# EAGLE schematic VentilationsEvaluationDevBoard_v2.1.4_USB_C (EAGLE 9.6.2)
TEST: 1234

## Sheet 1 of 3
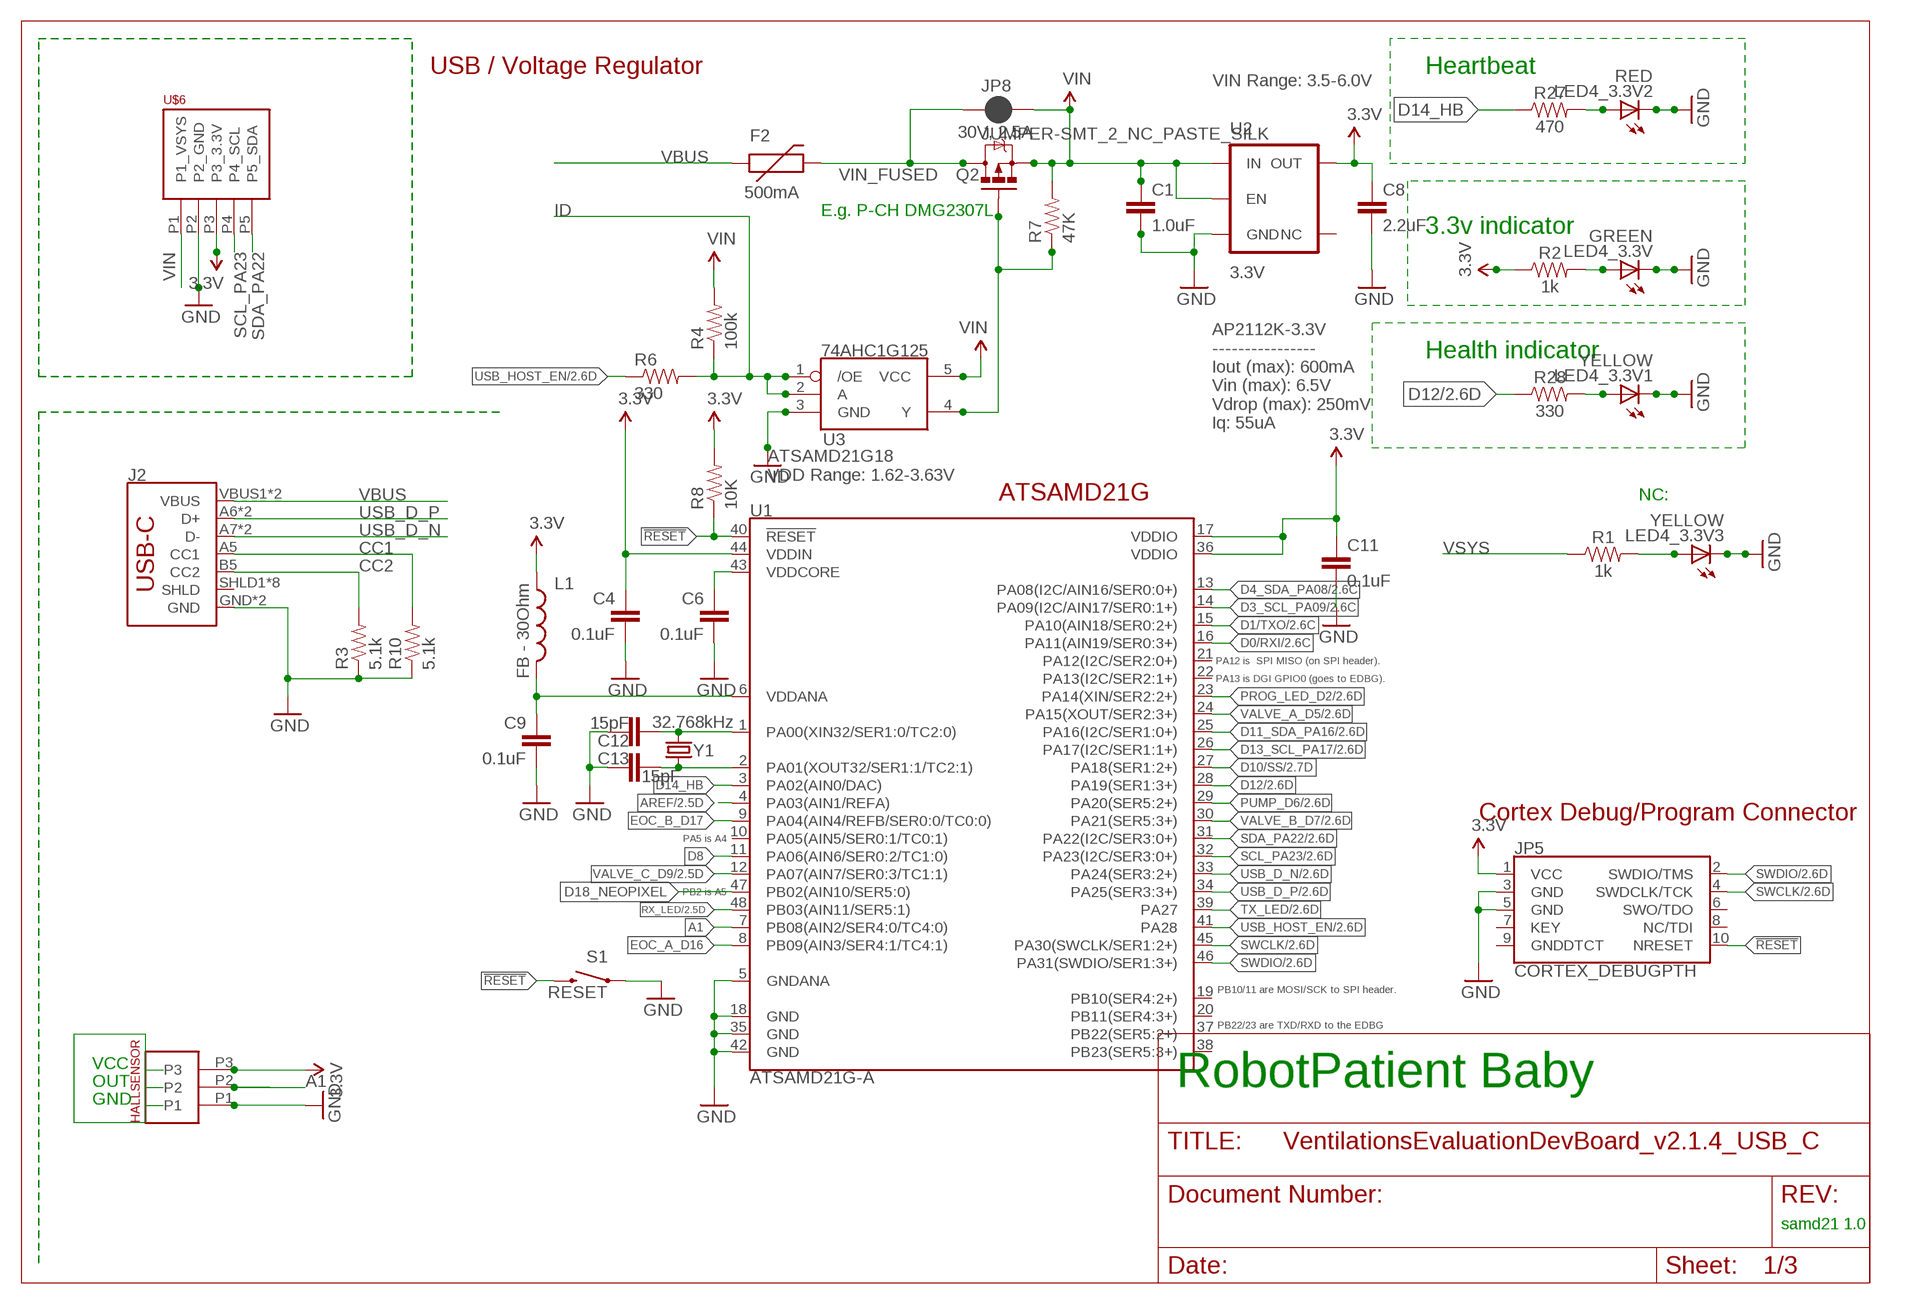
[diagram p0: schematic, sheet 1]

### Parts
C1  1.0uF  1.0UF-25V-+80/-20(0805)  [0805]
C4  0.1uF  0.1UF-16V(+-10%)(0402)  [0402-CAP]
C6  0.1uF  0.1UF-16V(+-10%)(0402)  [0402-CAP]
C8  2.2uF  2.2UF-10V-20%(0603)  [0603-CAP]
C9  0.1uF  0.1UF-16V(+-10%)(0402)  [0402-CAP]
C11  0.1uF  0.1UF-16V(+-10%)(0402)  [0402-CAP]
C12  15pF  15PF-50V(+-5%)(0402)  [0402-CAP]
C13  15pF  15PF-50V(+-5%)(0402)  [0402-CAP]
F2  500mA  PTCSMD  [PTC-1206]
HALLSENSOR  PHOENIX_PTSM_M3_TH_UP  [PTSM_M3_THR_UP]
J2  USB_C16PIN  [USB-C-16P]
JP5  CORTEX_DEBUGPTH  [2X5-PTH-1.27MM]
JP8  JUMPER-SMT_2_NC_PASTE_SILK  [SMT-JUMPER_2_NC_PASTE_SILK]
L1  FB - 30Ohm  INDUCTOR0603  [0603]
LED4_3.3V  GREEN  LED0603  [LED-0603]
LED4_3.3V1  YELLOW  LED0603  [LED-0603]
LED4_3.3V2  RED  LED0603  [LED-0603]
LED4_3.3V3  YELLOW  LED0603  [LED-0603]
Q2  30V, 2.5A  MOSFET-PCHANNELDMG2307L  [SOT23-3]
R1  1k  1KOHM-0603-1/10W-1%  [0603]
R2  1k  1KOHM-0603-1/10W-1%  [0603]
R3  5.1k  10KOHM-1/10W-1%(0603)0603  [0603-RES]
R4  100k  100KOHM-1/10W-1%(0603)  [0603-RES]
R6  330  330OHM1/10W1%(0603)  [0603-RES]
R7  47K  47KOHM1/10W1%(0603)  [0603-RES]
R8  10K  10KOHM-1/10W-1%(0603)0603  [0603-RES]
R10  5.1k  10KOHM-1/10W-1%(0603)0603  [0603-RES]
R27  470  470OHM-0603-1/10W-1%  [0603]
R28  330  330OHM-0603-1/10W-1%  [0603]
S1  RESET  SWITCH-MOMENTARY-2SMD-4.6X2.8MM  [TACTILE_SWITCH_SMD_4.6X2.8MM]
U1  ATSAMD21G-A  [TQFP-48]
U2  3.3V  V_REG_AP2112K-3.3V  [SOT23-5]
U3  74AHC1G125  [SOT23-5]
U$6  PHOENIX_PTSM_M5_TH_UP  [PTSM_M5_THR_UP]
Y1  32.768kHz  CRYSTAL3.2X1.5MM  [CRYSTAL-SMD-3.2X1.5MM]

### Nets
3.3V [power]: C4.1 C8.1 C11.1 HALLSENSOR.P3 JP5.1(VCC) L1.1 R2.1 R8.2 U1.17(VDDIO) U1.36(VDDIO) U1.44(VDDIN) U2.5(OUT) U$6.P3(P3_3.3V) ; also sheet 2,3
!RESET: JP5.10(NRESET) R8.1 S1.3 S1.4 U1.40(!RESET!)
A1: HALLSENSOR.P2 U1.7(PB08(AIN2/SER4:0/TC4:0))
AREF: U1.4(PA03(AIN1/REFA)) ; also sheet 2
CC1: J2.A5(CC1) R10.2
CC2: J2.B5(CC2) R3.2
D0/RXI: U1.16(PA11(AIN19/SER0:3+)) ; also sheet 2
D1/TXO: U1.15(PA10(AIN18/SER0:2+)) ; also sheet 2
D3_SCL_PA09: U1.14(PA09(I2C/AIN17/SER0:1+)) ; also sheet 2,3
D4_SDA_PA08: U1.13(PA08(I2C/AIN16/SER0:0+)) ; also sheet 2,3
D8: U1.11(PA06(AIN6/SER0:2/TC1:0))
D10/SS: U1.27(PA18(SER1:2+)) ; also sheet 2
D11_SDA_PA16: U1.25(PA16(I2C/SER1:0+)) ; also sheet 2,3
D12: R28.1 U1.28(PA19(SER1:3+)) ; also sheet 2
D13_SCL_PA17: U1.26(PA17(I2C/SER1:1+)) ; also sheet 2,3
D14_HB: R27.1 U1.3(PA02(AIN0/DAC))
D18_NEOPIXEL: U1.47(PB02(AIN10/SER5:0)) ; also sheet 2
EOC_A_D16: U1.8(PB09(AIN3/SER4:1/TC4:1)) ; also sheet 3
EOC_B_D17: U1.9(PA04(AIN4/REFB/SER0:0/TC0:0)) ; also sheet 3
GND [ground]: C1.2 C4.2 C6.2 C8.2 C9.2 C11.2 C12.1 C13.2 HALLSENSOR.P1 J2.GND J2.GND2(GND) JP5.3(GND) JP5.5(GND) LED4_3.3V1.C LED4_3.3V2.C LED4_3.3V3.C LED4_3.3V.C R3.1 R10.1 S1.1 S1.2 U1.5(GNDANA) U1.18(GND) U1.35(GND) U1.42(GND) U2.2(GND) U3.3(GND) U$6.P2(P2_GND) ; also sheet 2,3
ID: R4.1 R6.2 U3.1(/OE) U3.2(A)
N$1: LED4_3.3V2.A R27.2
N$2: LED4_3.3V1.A R28.2
N$3: LED4_3.3V3.A R1.2
N$8: C12.2 U1.1(PA00(XIN32/SER1:0/TC2:0)) Y1.P$2
N$12: Q2.1(G) R7.1 U3.4(Y)
N$13: C13.1 U1.2(PA01(XOUT32/SER1:1/TC2:1)) Y1.P$1
N$33: LED4_3.3V.A R2.2
PROG_LED_D2: U1.23(PA14(XIN/SER2:2+)) ; also sheet 2
PUMP_D6: U1.29(PA20(SER5:2+)) ; also sheet 2,3
RX_LED: U1.48(PB03(AIN11/SER5:1)) ; also sheet 2
SCL_PA23: U1.32(PA23(I2C/SER3:0+)) U$6.P4(P4_SCL) ; also sheet 2
SDA_PA22: U1.31(PA22(I2C/SER3:0+)) U$6.P5(P5_SDA) ; also sheet 2
SWCLK: JP5.4(SWDCLK/TCK) U1.45(PA30(SWCLK/SER1:2+)) ; also sheet 2
SWDIO: JP5.2(SWDIO/TMS) U1.46(PA31(SWDIO/SER1:3+)) ; also sheet 2
TX_LED: U1.39(PA27) ; also sheet 2
USB_D_N [diff_pair]: J2.A7(D-) J2.B7(D-) U1.33(PA24(SER3:2+)) ; also sheet 2
USB_D_P [diff_pair]: J2.A6(D+) J2.B6(D+) U1.34(PA25(SER3:3+)) ; also sheet 2
USB_HOST_EN: R6.1 U1.41(PA28) ; also sheet 2
VALVE_A_D5: U1.24(PA15(XOUT/SER2:3+)) ; also sheet 2,3
VALVE_B_D7: U1.30(PA21(SER5:3+)) ; also sheet 2,3
VALVE_C_D9: U1.12(PA07(AIN7/SER0:3/TC1:1)) ; also sheet 2,3
VBUS [power]: F2.1 J2.VBUS1(VBUS) J2.VBUS2(VBUS)
VDDANA [power]: C9.1 L1.2 U1.6(VDDANA)
VDDCORE [power]: C6.1 U1.43(VDDCORE)
VIN [power]: C1.1 JP8.2 Q2.2(S) R4.2 R7.2 U2.1(IN) U2.3(EN) U3.5(VCC) U$6.P1(P1_VSYS) ; also sheet 2
VIN_FUSED [power]: F2.2 JP8.1 Q2.3(D) ; also sheet 2
VSYS [power]: R1.1 ; also sheet 2
Unconnected: J2.SHLD1(SHLD) J2.SHLD2(SHLD) J2.SHLD3(SHLD) J2.SHLD4(SHLD) J2.SHLD5(SHLD) J2.SHLD6(SHLD) J2.SHLD7(SHLD) J2.SHLD8(SHLD) JP5.6(SWO/TDO) JP5.7(KEY) JP5.8(NC/TDI) JP5.9(GNDDTCT) U1.10(PA05(AIN5/SER0:1/TC0:1)) U1.19(PB10(SER4:2+)) U1.20(PB11(SER4:3+)) U1.21(PA12(I2C/SER2:0+)) U1.22(PA13(I2C/SER2:1+)) U1.37(PB22(SER5:2+)) U1.38(PB23(SER5:3+)) U2.4(NC)

### Notes on the sheet
- USB / Voltage Regulator
- VIN Range: 3.5-6.0V | Heartbeat
- E.g. P-CH DMG2307L
- 3.3v indicator
- AP2112K-3.3V
  ----------------
  Iout (max): 600mA 
  Vin (max): 6.5V
  Vdrop (max): 250mV
  Iq: 55uA
- Health indicator
- ATSAMD21G18
  VDD Range: 1.62-3.63V
- ATSAMD21G
- NC:
- PA12 is  SPI MISO (on SPI header).
- PA13 is DGI GPIO0 (goes to EDBG).
- Cortex Debug/Program Connector
- PA5 is A4
- PB2 is A5
- PB10/11 are MOSI/SCK to SPI header.
- PB22/23 are TXD/RXD to the EDBG
- VCC
- OUT | RobotPatient Baby
- GND
- samd21 1.0

## Sheet 2 of 3
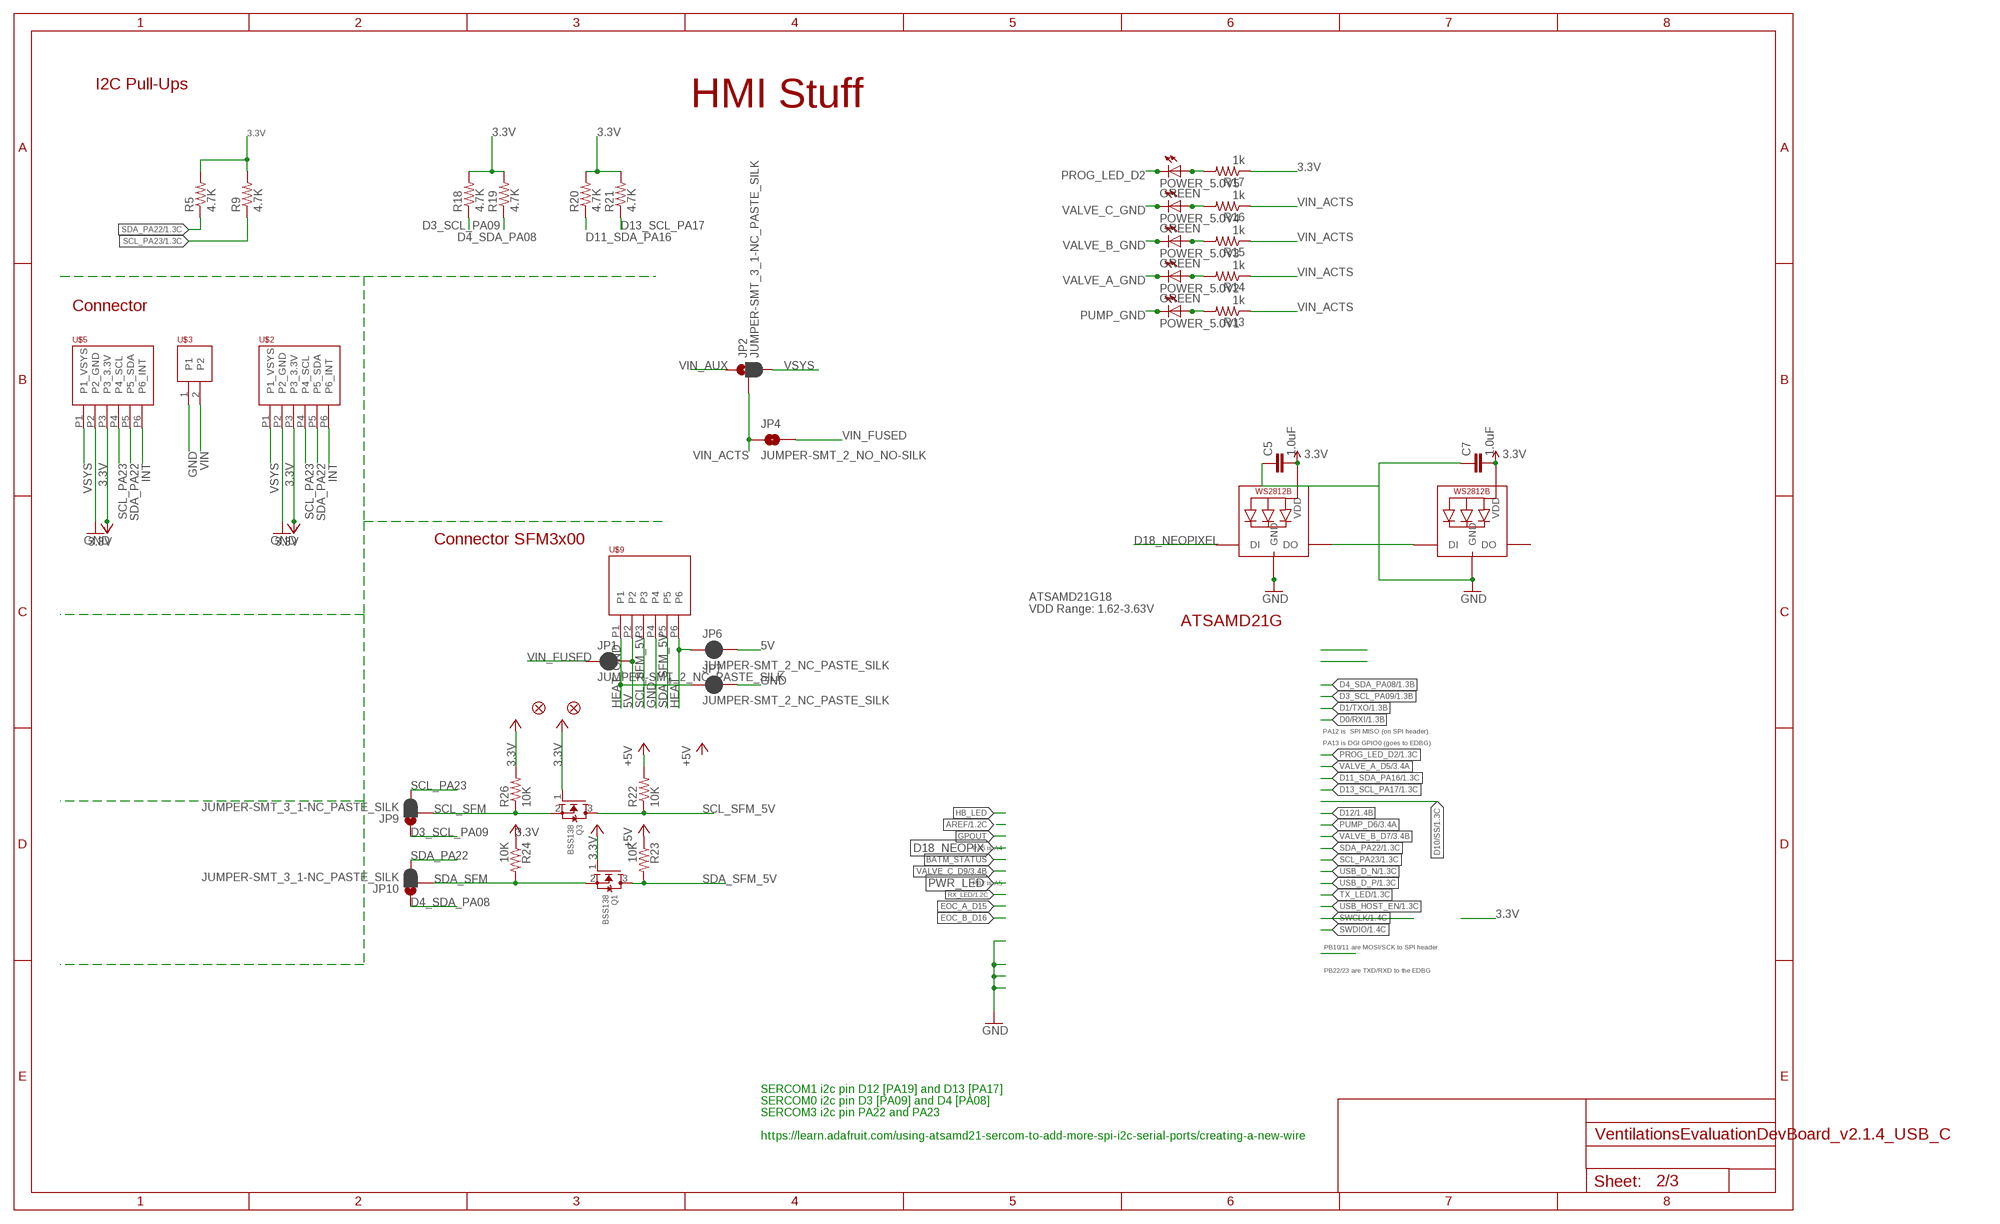
[diagram p1: schematic, sheet 2]

### Parts
C5  1.0uF  1.0UF-25V-+80/-20(0805)  [0805]
C7  1.0uF  1.0UF-25V-+80/-20(0805)  [0805]
FD1  FIDUCIAL1X2  [FIDUCIAL-1X2]
FD2  FIDUCIAL1X2  [FIDUCIAL-1X2]
JP1  JUMPER-SMT_2_NC_PASTE_SILK  [SMT-JUMPER_2_NC_PASTE_SILK]
JP2  JUMPER-SMT_3_1-NC_PASTE_SILK  [SMT-JUMPER_3_1-NC_PASTE_SILK]
JP4  JUMPER-SMT_2_NO_NO-SILK  [SMT-JUMPER_2_NO_NO-SILK]
JP6  JUMPER-SMT_2_NC_PASTE_SILK  [SMT-JUMPER_2_NC_PASTE_SILK]
JP7  JUMPER-SMT_2_NC_PASTE_SILK  [SMT-JUMPER_2_NC_PASTE_SILK]
JP9  JUMPER-SMT_3_1-NC_PASTE_SILK  [SMT-JUMPER_3_1-NC_PASTE_SILK]
JP10  JUMPER-SMT_3_1-NC_PASTE_SILK  [SMT-JUMPER_3_1-NC_PASTE_SILK]
LED1  WS2812B3535  [LED3535]
LED2  WS2812B3535  [LED3535]
POWER_5.0V1  GREEN  LED0603  [LED-0603]
POWER_5.0V2  GREEN  LED0603  [LED-0603]
POWER_5.0V3  GREEN  LED0603  [LED-0603]
POWER_5.0V4  GREEN  LED0603  [LED-0603]
POWER_5.0V5  GREEN  LED0603  [LED-0603]
Q1  BSS138  MOSFET-NREFLOW  [SOT23]
Q3  BSS138  MOSFET-NREFLOW  [SOT23]
R5  4.7K  4.7KOHM-1/10W-1%(0603)  [0603-RES@1]
R9  4.7K  4.7KOHM-1/10W-1%(0603)  [0603-RES@1]
R13  1k  10KOHM-1/10W-1%(0603)0603  [0603-RES]
R14  1k  10KOHM-1/10W-1%(0603)0603  [0603-RES]
R15  1k  10KOHM-1/10W-1%(0603)0603  [0603-RES]
R16  1k  10KOHM-1/10W-1%(0603)0603  [0603-RES]
R17  1k  10KOHM-1/10W-1%(0603)0603  [0603-RES]
R18  4.7K  4.7KOHM-1/10W-1%(0603)  [0603-RES@1]
R19  4.7K  4.7KOHM-1/10W-1%(0603)  [0603-RES@1]
R20  4.7K  4.7KOHM-1/10W-1%(0603)  [0603-RES@1]
R21  4.7K  4.7KOHM-1/10W-1%(0603)  [0603-RES@1]
R22  10K  R-US_R0805  [R0805]
R23  10K  R-US_R0805  [R0805]
R24  10K  R-US_R0805  [R0805]
R26  10K  R-US_R0805  [R0805]
U$2  PHOENIX_PTSM_M6_TH_I2CPPANGLE  [PTSM_M6_THRHOLE]
U$3  PHOENIX_PTSM_M2_TH  [PTSM_M2_THRHOLE]
U$5  PHOENIX_PTSM_M6_TH_I2CPPANGLE  [PTSM_M6_THRHOLE]
U$9  PHOENIX_PTSM_M6_TH_UP_NEUTRAL  [PTSM_M6_TH_UP_NEUTRAL]

### Nets
3.3V [power]: C5.2 C7.2 LED1.2(VDD) LED2.2(VDD) Q1.1(G) Q3.1(G) R5.2 R9.2 R17.1 R18.2 R19.2 R20.2 R21.2 R24.1 R26.2 U$2.P3(P3_3.3V) U$5.P3(P3_3.3V) ; supply symbol labelled +3V3 ; also sheet 1,3
5V [power]: JP1.2 JP6.2 R22.2 R23.1 U$9.P2 ; supply symbol labelled +5V
D3_SCL_PA09: JP9.1 R18.1 ; also sheet 1,3
D4_SDA_PA08: JP10.1 R19.1 ; also sheet 1,3
D11_SDA_PA16: R20.1 ; also sheet 1,3
D13_SCL_PA17: R21.1 ; also sheet 1,3
D18_NEOPIXEL: LED1.1(DI) ; also sheet 1
GND [ground]: C5.1 C7.1 JP7.2 LED1.4(GND) LED2.4(GND) U$2.P2(P2_GND) U$3.1 U$5.P2(P2_GND) U$9.P4 ; also sheet 1,3
HEAT [power]: JP6.1 U$9.P6
HEAT_GND [ground]: JP7.1 U$9.P1
INT: U$2.P6(P6_INT) U$5.P6(P6_INT)
N$24: POWER_5.0V1.A R13.2
N$25: POWER_5.0V2.A R14.2
N$27: POWER_5.0V3.A R15.2
N$28: POWER_5.0V4.A R16.2
N$29: POWER_5.0V5.A R17.2
NEOPIXEL_2: LED1.3(DO) LED2.1(DI)
PROG_LED_D2: POWER_5.0V5.C ; also sheet 1
PUMP_GND [ground]: POWER_5.0V1.C ; also sheet 3
SCL_PA23: JP9.3 R9.1 U$2.P4(P4_SCL) U$5.P4(P4_SCL) ; also sheet 1
SCL_SFM: JP9.2 Q3.2(S) R26.1
SCL_SFM_5V: Q3.3(D) R22.1 U$9.P3
SDA_PA22: JP10.3 R5.1 U$2.P5(P5_SDA) U$5.P5(P5_SDA) ; also sheet 1
SDA_SFM: JP10.2 Q1.2(S) R24.2
SDA_SFM_5V: Q1.3(D) R23.2 U$9.P5
VALVE_A_GND [ground]: POWER_5.0V2.C ; also sheet 3
VALVE_B_GND [ground]: POWER_5.0V3.C ; also sheet 3
VALVE_C_GND [ground]: POWER_5.0V4.C ; also sheet 3
VIN [power]: U$3.2 ; also sheet 1
VIN_ACTS [power]: JP2.2 JP4.1 R13.1 R14.1 R15.1 R16.1 ; also sheet 3
VIN_AUX: JP2.1
VIN_FUSED [power]: JP1.1 JP4.2 ; also sheet 1
VSYS [power]: JP2.3 U$2.P1(P1_VSYS) U$5.P1(P1_VSYS) ; also sheet 1
Unconnected: LED2.3(DO)

### Notes on the sheet
- I2C Pull-Ups | HMI Stuff
- Connector
- Connector SFM3x00
- ATSAMD21G18
  VDD Range: 1.62-3.63V
- ATSAMD21G
- PA12 is  SPI MISO (on SPI header).
- PA13 is DGI GPIO0 (goes to EDBG).
- PA5 is A4
- PB2 is A5
- PB10/11 are MOSI/SCK to SPI header.
- PB22/23 are TXD/RXD to the EDBG
- SERCOM1 i2c pin D12 [PA19] and D13 [PA17]
- SERCOM0 i2c pin D3 [PA09] and D4 [PA08]
- SERCOM3 i2c pin PA22 and PA23
- https://learn.adafruit.com/using-atsamd21-sercom-to-add-more-spi-i2c-serial-ports/creating-a-new-wire

## Sheet 3 of 3
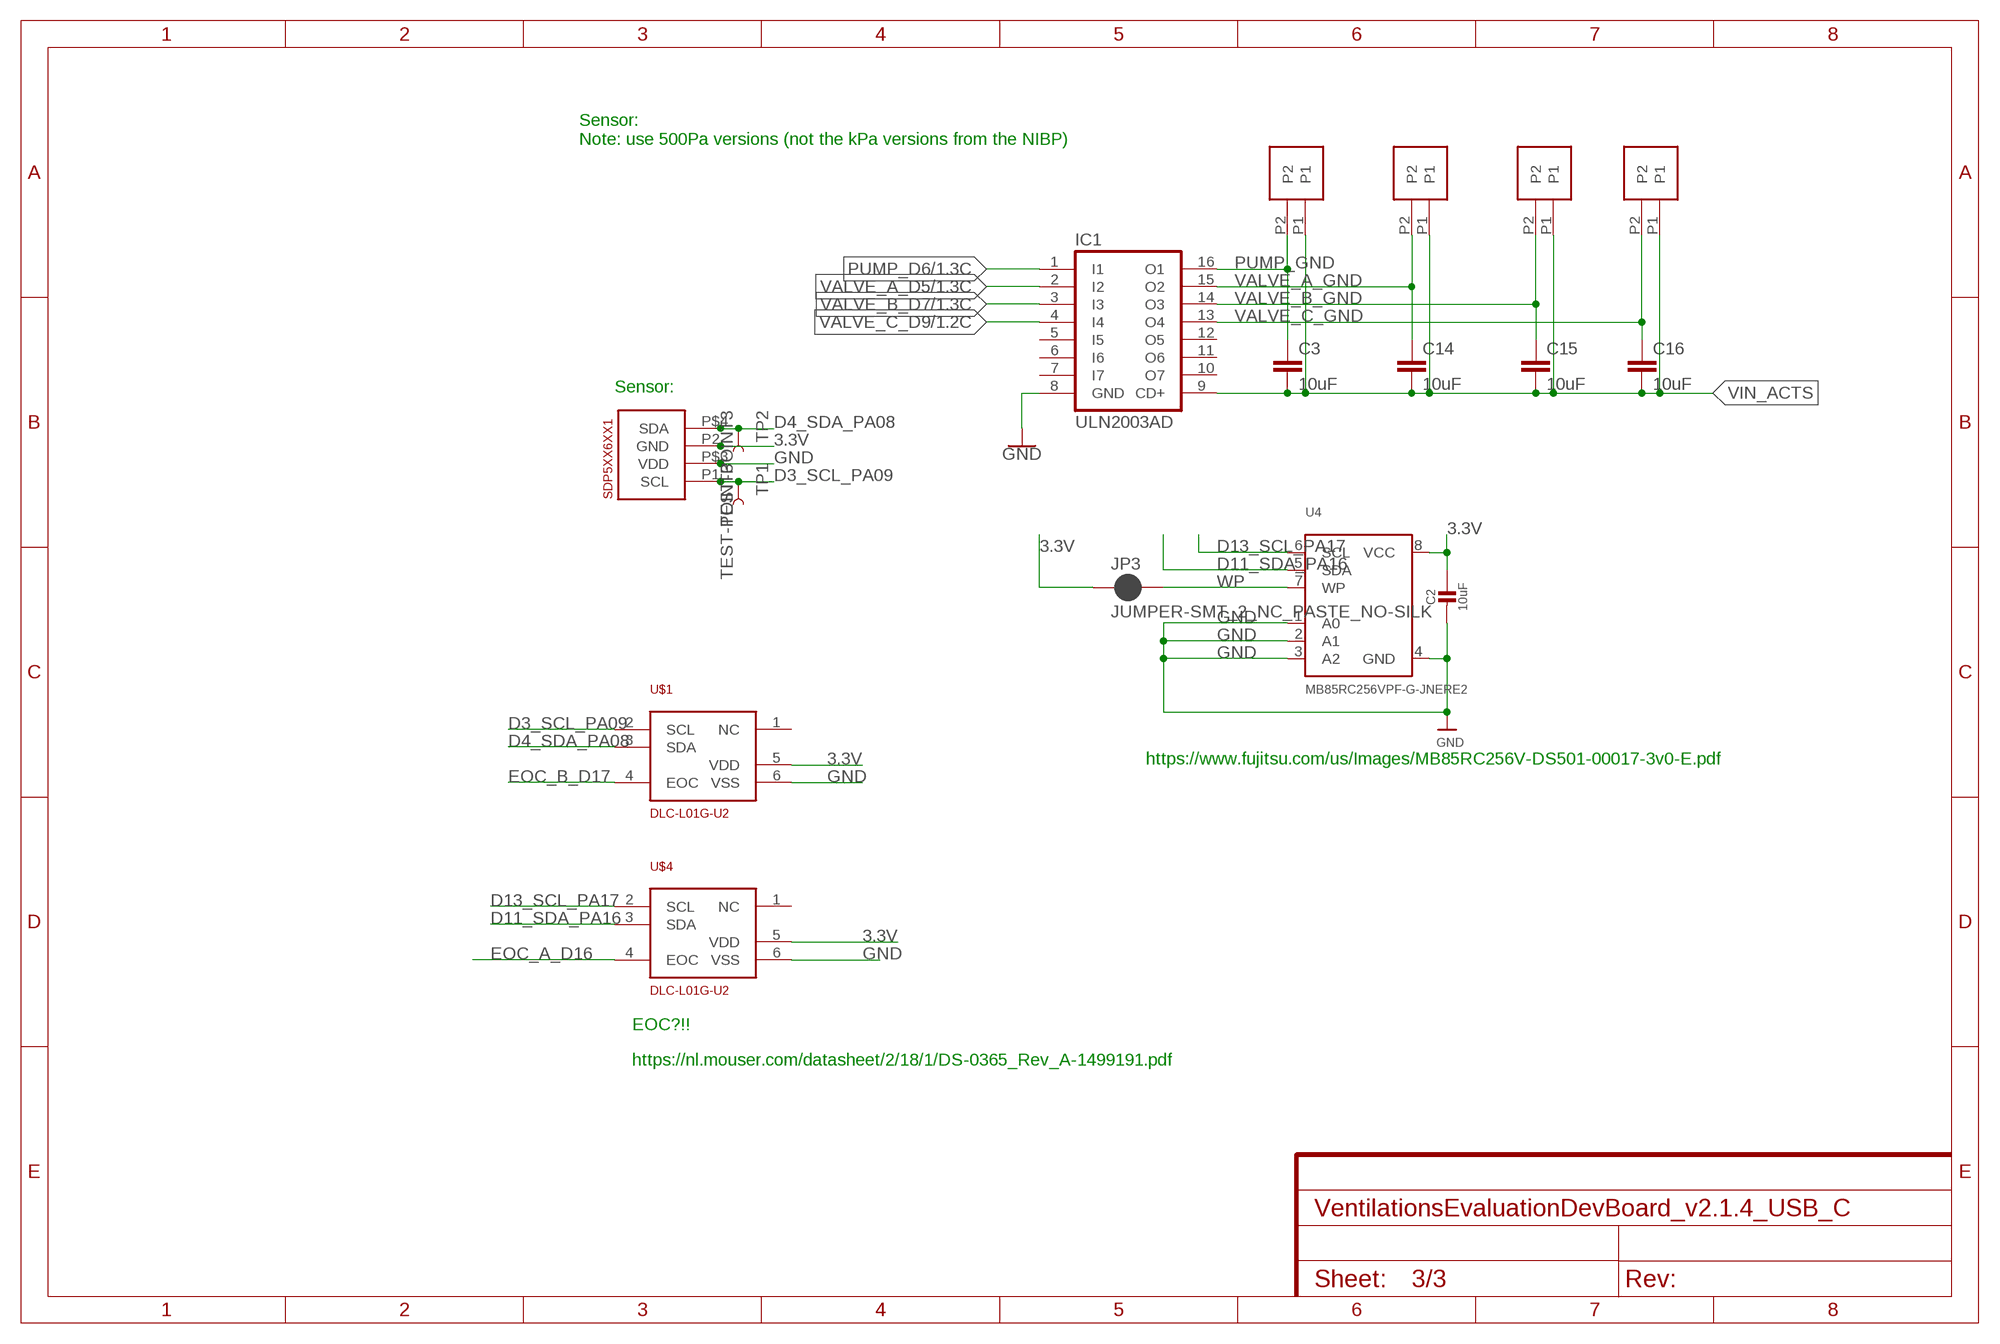
[diagram p2: schematic, sheet 3]

### Parts
C2  10uF  CAP_CERAMIC_0805MP  [_0805MP]
C3  10uF  10UF-0805-10V-10%  [0805]
C14  10uF  10UF-0805-10V-10%  [0805]
C15  10uF  10UF-0805-10V-10%  [0805]
C16  10uF  10UF-0805-10V-10%  [0805]
IC1  ULN2003AD  [SO16]
JP3  JUMPER-SMT_2_NC_PASTE_NO-SILK  [SMT-JUMPER_2_NC_PASTE_NO-SILK]
PUMP  PHOENIX_PTSM_M2_SMD  [PTSM_M2_SMD]
SDP5XX6XX1  SDP5XX_6XX  [SDP5XX_6XX]
TP1  TEST-POINT3  [PAD.03X.03]
TP2  TEST-POINT3  [PAD.03X.03]
U4  MB85RC256VPF-G-JNERE2  FRAM_SOIC8_I2C  [SOIC8_208MIL]
U$1  DLC-L01G-U2  [DLC-L01G-U2]
U$4  DLC-L01G-U2  [DLC-L01G-U2]
VALVE_A  PHOENIX_PTSM_M2_SMD  [PTSM_M2_SMD]
VALVE_B  PHOENIX_PTSM_M2_SMD  [PTSM_M2_SMD]
VALVE_C  PHOENIX_PTSM_M2_SMD  [PTSM_M2_SMD]

### Nets
3.3V [power]: C2.1 JP3.1 SDP5XX6XX1.P2(GND) U4.8(VCC) U$1.5(VDD) U$4.5(VDD) ; also sheet 1,2
D3_SCL_PA09: SDP5XX6XX1.P1(SCL) TP1.P$1 U$1.2(SCL) ; also sheet 1,2
D4_SDA_PA08: SDP5XX6XX1.P$4(SDA) TP2.P$1 U$1.3(SDA) ; also sheet 1,2
D11_SDA_PA16: U4.5(SDA) U$4.3(SDA) ; also sheet 1,2
D13_SCL_PA17: U4.6(SCL) U$4.2(SCL) ; also sheet 1,2
EOC_A_D16: U$4.4(EOC) ; also sheet 1
EOC_B_D17: U$1.4(EOC) ; also sheet 1
GND [ground]: C2.2 IC1.8(GND) SDP5XX6XX1.P$3(VDD) U4.1(A0) U4.2(A1) U4.3(A2) U4.4(GND) U$1.6(VSS) U$4.6(VSS) ; also sheet 1,2
PUMP_D6: IC1.1(I1) ; also sheet 1,2
PUMP_GND [ground]: C3.1 IC1.16(O1) PUMP.P2 ; also sheet 2
VALVE_A_D5: IC1.2(I2) ; also sheet 1,2
VALVE_A_GND [ground]: C14.1 IC1.15(O2) VALVE_A.P2 ; also sheet 2
VALVE_B_D7: IC1.3(I3) ; also sheet 1,2
VALVE_B_GND [ground]: C15.1 IC1.14(O3) VALVE_B.P2 ; also sheet 2
VALVE_C_D9: IC1.4(I4) ; also sheet 1,2
VALVE_C_GND [ground]: C16.1 IC1.13(O4) VALVE_C.P2 ; also sheet 2
VIN_ACTS [power]: C3.2 C14.2 C15.2 C16.2 IC1.9(CD+) PUMP.P1 VALVE_A.P1 VALVE_B.P1 VALVE_C.P1 ; also sheet 2
WP: JP3.2 U4.7(WP)
Unconnected: IC1.5(I5) IC1.6(I6) IC1.7(I7) IC1.10(O7) IC1.11(O6) IC1.12(O5) U$1.1(NC) U$4.1(NC)

### Notes on the sheet
- Sensor:
  Note: use 500Pa versions (not the kPa versions from the NIBP)
- Sensor:
- https://www.fujitsu.com/us/Images/MB85RC256V-DS501-00017-3v0-E.pdf
- EOC?!!
- https://nl.mouser.com/datasheet/2/18/1/DS-0365_Rev_A-1499191.pdf

## Library data of the parts
C1 C5 C7 = SparkFun-Capacitors:1.0UF-25V-+80/-20(0805): CAP-11625; PROD_ID: CAP-11625
C2 = microbuilder:CAP_CERAMIC: Ceramic Capacitors For new designs, use the packages preceded by an '_' character since they are more reliable: The following footprints should be used on most boards: _0402 - Standard footprint for regular board layouts _0603 - Standard footprint for regular board layouts _0805 - Standard footprint for regular board layouts _1206 - Standard footprint for regular board layouts For extremely tight-pitch boards where space is at a premium, the following 'micro-pitch' footprints can be used (smaller pads, no silkscreen outline, etc.): _0402MP - Micro-pitch footprint for very dense/compact boards _0603MP - Micro-pitch footprint for very dense/compact boards _0805MP - Micro-pitch footprint for very dense/compact boards _1206MP - Micro-pitch footprint for very dense/compact boards
C3 C14-C16 = SparkFun-Capacitors:10UF: 10.0µF ceramic capacitors A capacitor is a passive two-terminal electrical component used to store electrical energy temporarily in an electric field.; PROD_ID: CAP-11330
C4 C6 C9 C11 = SparkFun-Capacitors:0.1UF-16V(+-10%)(0402); PROD_ID: CAP-12416
C8 = SparkFun-Capacitors:2.2UF-10V-20%(0603): CAP-07888; PROD_ID: CAP-07888
C12 C13 = samd21-temp:15PF-50V(+-5%)(0402); PROD_ID: CAP-13063
F2 = SparkFun-PowerIC:PTC: Resettable Fuse PTC Resettable Fuse. Spark Fun Electronics SKU : COM-08357; PROD_ID: RES-11150
FD1 FD2 = SparkFun-Aesthetics:FIDUCIAL: Fiducial Alignment Points Point-of-reference for pick-and-place machines and other optical instruments.
HALLSENSOR = jk_customs:PHOENIX_PTSM_M3_TH_UP
IC1 = uln-udn:ULN2003A: DRIVER ARRAY
J2 = SparkFun-Connectors:USB_C: USB Type C 16Pin Connector Super Speed pins not available on the 16-pin purely SMD connector so this part is best for USB 2.0 implementations. D1 and D2 are tied together enabling D+/- no matter which way the cable is plugged into the connector. The two channel configuration pins (CC1/2) are exposed. These are normally connected to ground via 5.1k resistors but can be reconfigured for high current/high power applications.; PROD_ID: CONN-14122
JP1 JP3 JP6-JP8 = SparkFun-Jumpers:JUMPER-SMT_2_NC_PASTE: Normally closed solder jumper This jumper has an aperture in the stencil to allow solder paste to bridge the split in the wire so it's normally closed (NC). Wick off the solder to open the connection. Reapply solder to reclose the connection.
JP2 JP9 JP10 = SparkFun-Jumpers:JUMPER-SMT_3_1-NC_PASTE: Normally closed solder jumper (1 of 2 connections) This jumper has an aperture in the stencil to allow solder paste to bridge one of the two connections. One connection is normally closed (NC), while the other is normally open (NO). Wick off the solder to open the connection. Reapply solder to reclose the connection. Apply solder to the other side instead to change the current path.
JP4 = SparkFun-Jumpers:JUMPER-SMT_2_NO: Normally open jumper This jumper has two pads in close proximity to each other. Apply solder to close the connection. Round pads are easier to solder for beginners, but are a lot larger. SparkFun Product that uses the round pads: SparkFun EL Sequencer <https://www.sparkfun.com/products/12781>
JP5 = samd21-temp:CORTEX_DEBUG: Cortex Debug Connector Datasheet <http://infocenter.arm.com/help/topic/com.arm.doc.faqs/attached/13634/cortex_debug_connectors.pdf>
L1 = SparkFun-Passives:INDUCTOR: Inductors Basic Inductor/Choke - 0603 and 1206. Footprints are not proven and vary greatly between part numbers. SRN6045- 33uH, 20% 1.4A SDR0403-560KL - 56uH, 10%, 500mA RMS/740mA peak; PROD_ID: RES-07859
LED1 LED2 = microbuilder:WS2812B
LED4_3.3V LED4_3.3V1-LED4_3.3V3 POWER_5.0V1-POWER_5.0V5 = SparkFun:LED: LEDs Standard schematic elements and footprints for 5mm, 3mm, 1206, and 0603 sized LEDs. 5mm - Spark Fun Electronics SKU : COM-00529 (and others)
PUMP VALVE_A VALVE_B VALVE_C = jk_customs:PHOENIX_PTSM_M2_SMD
Q1 Q3 = adafruit:MOSFET-N: N-Channel Mosfet 2N7002E - 60V 260mA SOT23 [Digikey: 2N7002ET1GOSTR-ND] - REEL BSH103 - 30V 850mA SOT23 [Digikey: 568-5013-1-ND]
Q2 = SparkFun-DiscreteSemi:MOSFET-PCHANNEL: Generic PMOSFET IRLML2244 - TRANS-11153 (SOT-23 -20V -4.3A) (1.Gate 2.Source 3.Drain) FQP27P06 - COM-10349 <http://www.sparkfun.com/products/10349> (TO-220 -60V -27A) (1.Gate 2.Source 3.Drain); PROD_ID: TRANS-11308
R1 R2 = SparkFun-Resistors:1KOHM: 1kΩ resistor A resistor is a passive two-terminal electrical component that implements electrical resistance as a circuit element. Resistors act to reduce current flow, and, at the same time, act to lower voltage levels within circuits. - Wikipedia; PROD_ID: RES-07856
R3 R10 R13-R17 = SparkFun-Resistors:10KOHM-1/10W-1%(0603): RES-00824; PROD_ID: RES-00824; VALUE: 10K
R4 = SparkFun-Resistors:100KOHM-1/10W-1%(0603): RES-07828; PROD_ID: RES-07828
R5 R9 R18-R21 = SparkFun-Resistors:4.7KOHM-1/10W-1%(0603): RES-07857; PROD_ID: RES-07857
R6 = SparkFun-Resistors:330OHM1/10W1%(0603): RES-00818; PROD_ID: RES-00818
R7 = SparkFun-Resistors:47KOHM1/10W1%(0603): RES-07871; PROD_ID: RES-07871
R8 = SparkFun-Resistors:10KOHM-1/10W-1%(0603): RES-00824; PROD_ID: RES-00824
R22-R24 R26 = adafruit:R-US_: RESISTOR, American symbol
R27 = SparkFun-Resistors:470OHM: 470Ω resistor A resistor is a passive two-terminal electrical component that implements electrical resistance as a circuit element. Resistors act to reduce current flow, and, at the same time, act to lower voltage levels within circuits. - Wikipedia; PROD_ID: RES-07869
R28 = SparkFun-Resistors:330OHM: 330Ω resistor A resistor is a passive two-terminal electrical component that implements electrical resistance as a circuit element. Resistors act to reduce current flow, and, at the same time, act to lower voltage levels within circuits. - Wikipedia; PROD_ID: RES-00818
S1 = samd21-temp:SWITCH-MOMENTARY-2: Various NO switches- pushbuttons, reed, etc; PROD_ID: SWCH-13065
SDP5XX6XX1 = jk_customs:SDP5XX_6XX: Sensirion SDP600 Series (SDP6xx/5xx) Low-cost Digital Differential Pressure Sensor
TP1 TP2 = SparkFun-Connectors:TEST-POINT: SparkFun Test Points Bare copper test points for troubleshooting or In-Circuit-Testing. These are used by our Production team for verifying production board runs using pogo-pins on test beds. SparkFun Products: SparkFun LSM9DS1 Breakout <https://www.sparkfun.com/products/13284> SparkFun PSOC <https://www.sparkfun.com/products/13714> SparkFun Load Cell Amplifier <https://www.sparkfun.com/products/13879>
U1 = samd21-temp:ATSAMD21G: Atmel SAMD21G SMART ARM-Based Microcontroller The Atmel ® | SMART ™ SAM D21 is a series of low-power microcontrollers using the 32-bit ARM ® Cortex ® -M0+ processor, and ranging from 32- to 64-pins with up to 256KB Flash and 32KB of SRAM. The SAM D21 devices operate at a maximum frequency of 48MHz and reach 2.46 CoreMark/MHz. They are designed for simple and intuitive migration with identical peripheral modules, hex compatible code, identical linear address map and pin compatible migration paths between all devices in the product series. All devices include intelligent and flexible peripherals, Atmel Event System for inter-peripheral signaling, and support for capacitive touch button, slider and wheel user interfaces.; PROD_ID: IC-13064
U2 = SparkFun-PowerIC:V_REG_AP2112: AP2112 - 600mA CMOS LDO Regulator w/ Enable The AP2112 is CMOS process low dropout linear regulator with enable function, the regulator delivers a guaranteed 600mA (min.) continuous load current. Features Output Voltage Accuracy: ±1.5% Output Current: 600mA (Min.) Foldback Short Current Protection: 50mA Enable Function to Turn ON/OFF VOUT Low Dropout Voltage (3.3V): 250mV (Typ.) @IOUT=600mA Excellent Load Regulation: 0.2%/A (Typ.) Excellent Line Regulation: 0.02%/V (Typ.) Low Quiescent Current: 55μA (Typ.) Low Standby Current: 0.01μA (Typ.) Low Output Noise: 50μVRMS PSRR: 100Hz -65dB, 1kHz -65dB OTSD Protection Stable with 1.0μF Flexible Cap: Ceramic, Tantalum and Aluminum Electrolytic Operation Temperature Range: -40°C to 85°C ESD: MM 400V, HBM 4000V; PROD_ID: VREG-12457
U3 = SparkFun-DigitalIC:74AHC1G125: Single bus buffer gate with 3-state output
U4 = microbuilder:FRAM_SOIC8_I2C: I2C FRAM - SOIC8 Package 256KBit (32Kx8) - MB85RC256VPF-G-JNERE2 - SOIC-8 200 Mil, 2.7-5.5V, -40°C-85°C
U$1 U$4 = jk_customs:DLC-L01G-U2
U$2 U$5 = jk_customs:PHOENIX_PTSM_M6_TH_I2CPP
U$3 = jk_customs:PHOENIX_PTSM_M2_TH
U$6 = jk_customs:PHOENIX_PTSM_M5_TH_UP: Datasheet <https://www.phoenixcontact.com/online/portal/us?uri=pxc-oc-itemdetail:pid=1778586&library=usen&pdfmode=direct&pdflanguage=en>
U$9 = jk_customs:PHOENIX_PTSM_M6_TH_UP_NEUTRAL
Y1 = samd21-temp:CRYSTAL: Various standard crystals. Proven footprints.; PROD_ID: XTAL-13062

## Net classes
2 ground: width 0.254 mm, drill 0.254 mm, clearance 0.152 mm
3 power: width 0.33 mm, drill 0.254 mm, clearance 0.152 mm